# Altium schematic sheet Isolation.SchDoc
size A; SheetNumber: 3; SheetTotal: 3
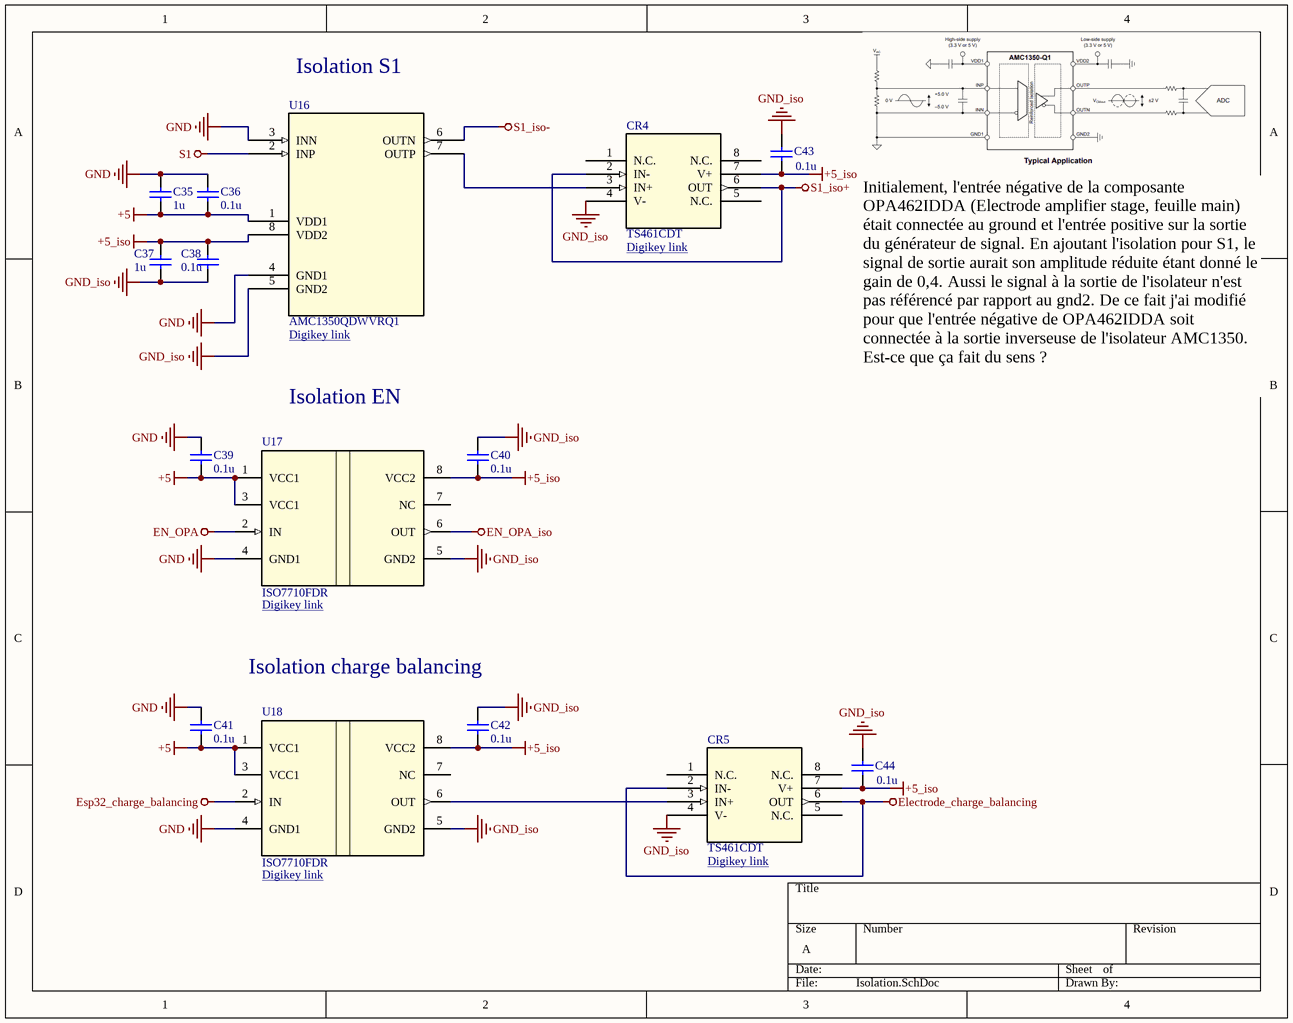
[diagram p0: Isolation.SchDoc]

## Parts
C35  value 1u  [0805_AVX]  (hidden comment: Capacitor)
C36  value 0.1u  [CAPC2012X150N]  (hidden comment: Capacitor)
C37  value 1u  [0805_AVX]  (hidden comment: Capacitor)
C38  value 0.1u  [CAPC2012X150N]  (hidden comment: Capacitor)
C39  value 0.1u  [CAPC2012X150N]  (hidden comment: Capacitor)
C40  value 0.1u  [CAPC2012X150N]  (hidden comment: Capacitor)
C41  value 0.1u  [CAPC2012X150N]  (hidden comment: Capacitor)
C42  value 0.1u  [CAPC2012X150N]  (hidden comment: Capacitor)
C43  value 0.1u  [CAPC2012X150N]  (hidden comment: Capacitor)
C44  value 0.1u  [CAPC2012X150N]  (hidden comment: Capacitor)
CR4  TS461CDT  [SO-8_STM]
CR5  TS461CDT  [SO-8_STM]
U16  AMC1350QDWVRQ1  [AMC1350QDWVRQ1_TEX]
U17  ISO7710FDR  [D0008B_N]
U18  ISO7710FDR  [D0008B_N]

## Nets
+5: C35.2 C36.1 C39.2 C41.2 U16.1(VDD1) U17.1(VCC1) U17.3(VCC1) U18.1(VCC1) U18.3(VCC1)
+5_iso: C37.1 C38.2 C40.2 C42.2 C43.2 C44.2 CR4.7(V+) CR5.7(V+) U16.8(VDD2) U17.8(VCC2) U18.8(VCC2)
Electrode_charge_balancing: CR5.2(IN-) CR5.6(OUT)
EN_OPA: U17.2(IN)
EN_OPA_iso: U17.6(OUT)
Esp32_charge_balancing: U18.2(IN)
GND: C35.1 C36.2 C39.1 C41.1 U16.3(INN) U16.4(GND1) U17.4(GND1) U18.4(GND1)
GND_iso: C37.2 C38.1 C40.1 C42.1 C43.1 C44.1 CR4.4(V-) CR5.4(V-) U16.5(GND2) U17.5(GND2) U18.5(GND2)
S1: U16.2(INP)
S1_iso+: CR4.2(IN-) CR4.6(OUT)
S1_iso-: U16.6(OUTN)
NetCR4_3: CR4.3(IN+) U16.7(OUTP)
NetCR5_3: CR5.3(IN+) U18.6(OUT)

Not connected (* = marked no-connect by the designer): CR4 1(N.C.) 5(N.C.) 8(N.C.); CR5 1(N.C.) 5(N.C.) 8(N.C.); U17 7(NC); U18 7(NC)

## Notes on the sheet
- Isolation S1
- (near CR4) Digikey link <https://www.digikey.ca/en/products/detail/stmicroelectronics/TS461CDT/599260?s=N4IgTCBcDaICoGUAsA2AjAYQCJxAXQF8g>
- (near U16) Digikey link <https://www.digikey.ca/en/products/detail/texas-instruments/AMC1350QDWVRQ1/16184258?gclsrc=aw.ds&gad_source=1&gad_campaignid=23536462204&gbraid=0AAAAADrbLlgPIMavqT0FMg8RnG3SAJlVn&gclid=CjwKCAjwtp7VBhBjEiwAJfpV-7trzx5dm_GJ_BDihVdM6MrJPevNCHBW8ri5qEOeuZCw5XcXnlMmKhoCRM0QAvD_BwE>
- Isolation EN
- Initialement, l'entrée négative de la composante OPA462IDDA (Electrode amplifier stage, feuille main) était connectée au ground et l'entrée positive sur la sortie du générateur de signal. En ajoutant l'isolation pour S1, le signal de sortie aurait son amplitude réduite étant donné le gain de 0,4. Aussi le signal à la sortie de l'isolateur n'est pas référencé par rapport au gnd2. De ce fait j'ai modifié pour que l'entrée négative de OPA462IDDA soit connectée à la sortie inverseuse de l'isolateur AMC1350. Est-ce que ça fait du sens ?
- (near U17) Digikey link <https://www.digikey.ca/en/products/detail/texas-instruments/ISO7710FDR/7173733>
- Isolation charge balancing
- (near U18) Digikey link <https://www.digikey.ca/en/products/detail/texas-instruments/ISO7710FDR/7173733>
- (near CR5) Digikey link <https://www.digikey.ca/en/products/detail/stmicroelectronics/TS461CDT/599260?s=N4IgTCBcDaICoGUAsA2AjAYQCJxAXQF8g>

## Library data of the parts
C35-C44 = Capacitor: SimulationGenericComponent: True
CR4 CR5 = TS461CDT: Output rail-to-rail op-amps; Manufacturer_Name: STMicroelectronics; Copyright: Copyright (C) 2026 Ultra Librarian. All rights reserved.; Manufacturer_Part_Number: TS461CDT; Datasheet: https://www.st.com/resource/en/datasheet/ts461.pdf; RefDes: RefDes; Type: Type
U16 = AMC1350QDWVRQ1: Automotive, &plusmn;5-V input, precision voltage sensing reinforced isolated amplifier 8-SOIC -40 to 125; Manufacturer_Name: Texas Instruments; Copyright: Copyright (C) 2026 Ultra Librarian. All rights reserved.; Manufacturer_Part_Number: AMC1350QDWVRQ1; RefDes: RefDes; Type: Type
U17 U18 = ISO7710FDR: Robust EMC, single-channel, reinforced digital isolator 8-SOIC -55 to 125; Manufacturer_Name: Texas Instruments; TYPE: TYPE; RefDes: RefDes; Copyright: Copyright (C) 2026 Ultra Librarian. All rights reserved.; Manufacturer_Part_Number: ISO7710FDR